# Altium schematic sheet freq-meter.schdoc
size 220 x 160 mm; Symbol: Sheet-Symbol_A5; Device: Sheet-Symbol_A5; Company: 嘉立创EDA; Version: V1.0; Page Size: A5; @Project Name: 51单片机最小系统; @Page Count: 1; @Update Date: 2025-10-24; @Create Date: 2025-10-24; @Schematic Name: Schematic1; @Page No: 1; @Page Name: P1_1; @Board Name: Board2; @Create Time: 05:46:19; @Update Time: 13:48:50
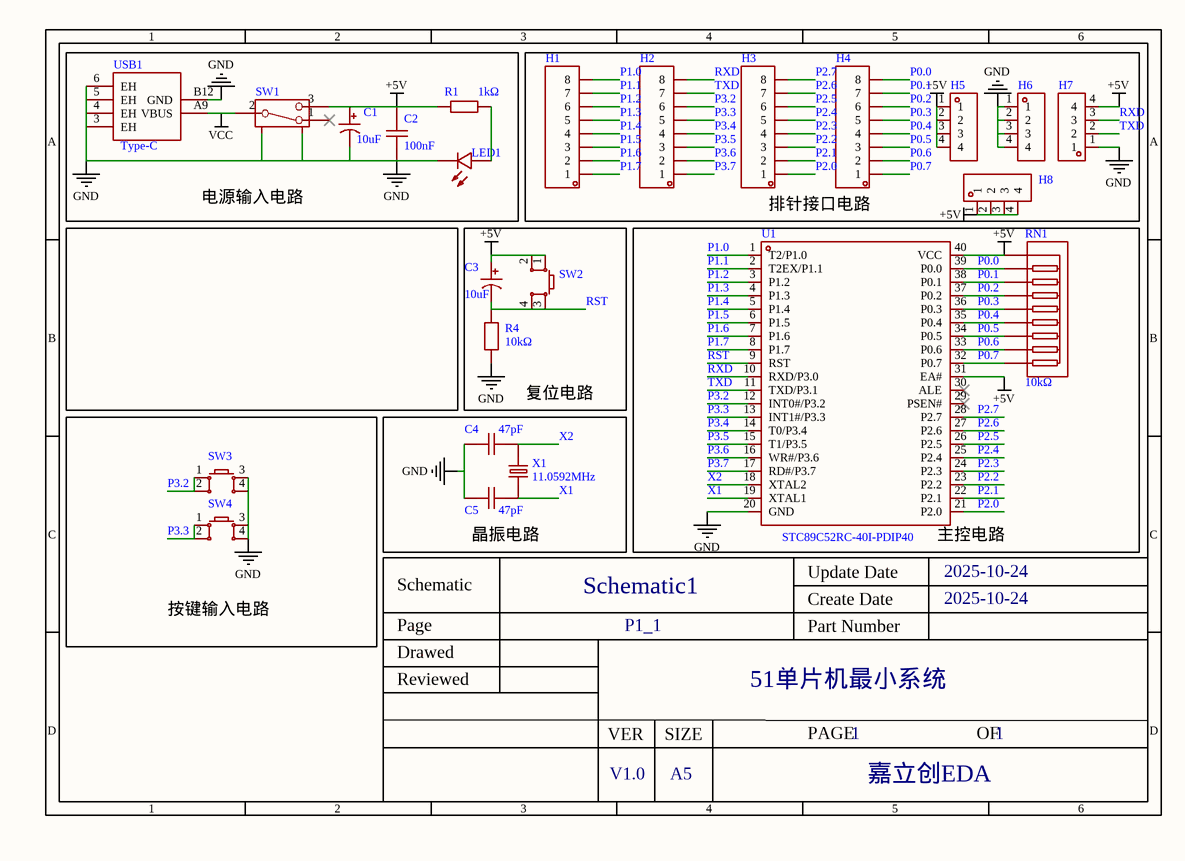
[diagram p0: freq-meter.schdoc]

## Parts
C1  10uF  [CAP-TH_BD5.0-P2.00-D0.8-FD]
C2  100nF  [CAP-TH_L8.5-W5.0-P5.00-D1.2]
C3  10uF  [CAP-TH_BD5.0-P2.00-D0.8-FD]
C4  47pF  [CAP-TH_L4.5-W3.0-P5.00-D1.2]
C5  47pF  [CAP-TH_L4.5-W3.0-P5.00-D1.2]
H1  (no value)  [HDR-TH_8P-P2.54-V-M]
H2  (no value)  [HDR-TH_8P-P2.54-V-M]
H3  (no value)  [HDR-TH_8P-P2.54-V-M]
H4  (no value)  [HDR-TH_8P-P2.54-V-M]
H5  (no value)  [HDR-TH_4P-P2.54-V-M]
H6  (no value)  [HDR-TH_4P-P2.54-V-M]
H7  (no value)  [HDR-TH_4P-P2.54-V-M]
H8  (no value)  [HDR-TH_4P-P2.54-V-M]
LED1  204-10SURD/S530-A3-L  [LED-TH_BD3.0-P2.54-FD]  (value not drawn)
R1  1kΩ  [RES-TH_BD2.5-L6.5-P10.50-D0.6]
R4  10kΩ  [RES-TH_BD2.4-L6.3-P10.30-D0.6]
RN1  10kΩ  [RES-ARRAY-TH_9P-P2.54-D1.0]
SW1  SS-12D02-VG4  [SW-TH_SS-12D02-VG4]  (value not drawn)
SW2  (no value)  [SW-TH_4P-L6.0-W6.0-P4.50-LS6.5]
SW3  (no value)  [SW-TH_4P-L6.0-W6.0-P4.50-LS6.5]
SW4  (no value)  [SW-TH_4P-L6.0-W6.0-P4.50-LS6.5]
U1  STC89C52RC-40I-PDIP40  [DIP-40_L52.0-W13.7-P2.54-LS15.2-BL]
USB1  Connector Type: Type-C  [USB-C-TH_TYPE-C-31-M-33]  (hidden comment: TYPE-C-31-M-33)
X1  11.0592MHz  [HC-49US_L11.5-W4.5-P4.88]

## Blocks framed on the sheet
电源输入电路: C1 C2 LED1 R1 SW1 USB1
排针接口电路: H1-H8
复位电路: C3 R4 SW2
主控电路: RN1 U1
按键输入电路: SW3 SW4
晶振电路: C4 C5 X1

## Nets
+5V: C1.1 C2.2 C3.1 H5.1 H5.2 H5.3 H5.4 H7.4 H8.1 H8.2 H8.3 H8.4 R1.1 RN1.1 SW1.3 SW2.1 SW2.2 U1.31(EA#) U1.40(VCC)
GND: C1.2 C2.1 C4.1 C5.1 H6.1 H6.2 H6.3 H6.4 H7.1 LED1.2(K) R4.1 SW1.4 SW1.5 SW3.3 SW3.4 SW4.3 SW4.4 U1.20(GND) USB1.3(EH) USB1.4(EH) USB1.5(EH) USB1.6(EH) USB1.B12(GND)
VCC: SW1.2 USB1.A9(VBUS)
P0.0: H4.8 RN1.2 U1.39(P0.0)
P0.1: H4.7 RN1.3 U1.38(P0.1)
P0.2: H4.6 RN1.4 U1.37(P0.2)
P0.3: H4.5 RN1.5 U1.36(P0.3)
P0.4: H4.4 RN1.6 U1.35(P0.4)
P0.5: H4.3 RN1.7 U1.34(P0.5)
P0.6: H4.2 RN1.8 U1.33(P0.6)
P0.7: H4.1 RN1.9 U1.32(P0.7)
P1.0: H1.8 U1.1(T2/P1.0)
P1.1: H1.7 U1.2(T2EX/P1.1)
P1.2: H1.6 U1.3(P1.2)
P1.3: H1.5 U1.4(P1.3)
P1.4: H1.4 U1.5(P1.4)
P1.5: H1.3 U1.6(P1.5)
P1.6: H1.2 U1.7(P1.6)
P1.7: H1.1 U1.8(P1.7)
P2.0: H3.1 U1.21(P2.0)
P2.1: H3.2 U1.22(P2.1)
P2.2: H3.3 U1.23(P2.2)
P2.3: H3.4 U1.24(P2.3)
P2.4: H3.5 U1.25(P2.4)
P2.5: H3.6 U1.26(P2.5)
P2.6: H3.7 U1.27(P2.6)
P2.7: H3.8 U1.28(P2.7)
P3.2: H2.6 SW3.1 SW3.2 U1.12(INT0#/P3.2)
P3.3: H2.5 SW4.1 SW4.2 U1.13(INT1#/P3.3)
P3.4: H2.4 U1.14(T0/P3.4)
P3.5: H2.3 U1.15(T1/P3.5)
P3.6: H2.2 U1.16(WR#/P3.6)
P3.7: H2.1 U1.17(RD#/P3.7)
RST: C3.2 R4.2 SW2.3 SW2.4 U1.9(RST)
RXD: H2.8 H7.3 U1.10(RXD/P3.0)
TXD: H2.7 H7.2 U1.11(TXD/P3.1)
X1: C5.2 U1.19(XTAL1) X1.1
X2: C4.2 U1.18(XTAL2) X1.2
NetLED1_1: LED1.1(A) R1.2

Not connected (* = marked no-connect by the designer): SW1 1*; U1 29(PSEN#)* 30(ALE)*

## Notes on the sheet
- 1
- 2
- 3
- 4
- 5
- 6
- A
- B
- C
- Schematic
- Schematic1
- Create Date
- Update Date
- 2025-10-24
- Reviewed
- Drawed
- Page
- P1_1
- Part Number
- 51单片机最小系统
- D
- VER
- SIZE
- PAGE
- OF
- V1.0
- A5
- 嘉立创EDA

## Library data of the parts
C1 C3 = KM106M050D11RR0VH2FP0: Manufacturer: CX(承兴); Symbol: 10uF 50V 5*11; Add into BOM: yes; Tolerance: ±20%; Rated Voltage: 50V; φD: 5mm; L: 11mm; Lifetime @ Temp: 1000hrs@105℃; Device: KM106M050D11RR0VH2FP0; LCSC Part Name: 10uF ±20% 50V; Supplier Part: C43345; Manufacturer Part: KM106M050D11RR0VH2FP0; Supplier Footprint: 插件,D5xL11mm; JLCPCB Part Class: Extended Part; Datasheet: https://atta.szlcsc.com/upload/public/pdf/source/20211027/06D6BA3719C264B639DC286D935D03EA.pdf; Supplier: LCSC; Convert to PCB: yes; Value: 10uF; Lead Spacing: 2mm
C2 = CT4-0805B104K500F3: Manufacturer: FH(风华); Add into BOM: yes; Tolerance: ±10%; Voltage Rated: 50V; Temperature Coefficient: X7R; Symbol: CT4-0805B104K500F3; Device: CT4-0805B104K500F3; LCSC Part Name: 100nF ±10% 50V; Supplier Part: C84772; Manufacturer Part: CT4-0805B104K500F3; Supplier Footprint: 插件,P=5.08mm; JLCPCB Part Class: Extended Part; Datasheet: https://atta.szlcsc.com/upload/public/pdf/source/20161024/1477288669695.pdf; Supplier: LCSC; Convert to PCB: yes; Value: 100nF
C4 C5 = CC1H470JC74DCH4B10MN: Manufacturer: Dersonic(德尔创); Add into BOM: yes; Tolerance: ±5%; Voltage Rated: 50V; Temperature Coefficient: NP0; φD: 4.7mm; Body Thickness: 2.2mm; Symbol: CC1H470JC74DCH4B10MN; Device: CC1H470JC74DCH4B10MN; LCSC Part Name: 47pF ±5% 50V; Supplier Part: C254104; Manufacturer Part: CC1H470JC74DCH4B10MN; Supplier Footprint: 径向引线,P=5.08mm; JLCPCB Part Class: Extended Part; Datasheet: https://atta.szlcsc.com/upload/public/pdf/source/20200826/C254104_4D3B00F203A17FA56AC5131CB4177D5E.pdf; Supplier: LCSC; Convert to PCB: yes; Value: 47pF; Lead Spacing: 5.08mm
H1-H4 = HDR-M_2.54_1x8P: Symbol: Header-Male-2.54_1x8; Convert to PCB: yes; Check: false; Device: HDR-M_2.54_1x8P; Add into BOM: yes; Supplier Part: C124381; Supplier Footprint: 插件
H5-H8 = HDR-M_2.54_1x4P: Symbol: PZ254V-11-04P; Convert to PCB: yes; Check: false; Device: HDR-M_2.54_1x4P; Add into BOM: yes; Supplier Part: C492403; Supplier Footprint: 插件
LED1 = 204-10SURD/S530-A3-L: Manufacturer: EVERLIGHT(亿光); Add into BOM: yes; Emitted Color: 红灯; Lens Color: 雾状红; Dominant Wavelength: 624nm; Peak Wavelength: 632nm; Forward Current: 20mA; Power Dissipation: 60mW; Viewing Angle: 40°; Lamp Holder Type: 3mm圆形灯头; Symbol: 204-10SURD/S530-A3-L; Device: 204-10SURD/S530-A3-L; LCSC Part Name: 红灯 624nm; Supplier Part: C99771; Manufacturer Part: 204-10SURD/S530-A3-L; Supplier Footprint: 插件,D=3mm; JLCPCB Part Class: Extended Part; Datasheet: https://atta.szlcsc.com/upload/public/pdf/source/20170504/1493866972127.pdf; Supplier: LCSC; Convert to PCB: yes; Diode Configuration: -; Color Temperature: -; Mounting Sytle: -; Operating Temperature: -40℃~+85℃
R1 = MFR0W4F1001A50: Manufacturer: UNI-ROYAL(厚声); Add into BOM: yes; Tolerance: ±1%; Power(Watts): 250mW; Temperature Coefficient: ±50ppm/℃; Symbol: MFR0W4F1001A50; Device: MFR0W4F1001A50; LCSC Part Name: 金属膜电阻 1kΩ ±1% 250mW; Supplier Part: C57435; Manufacturer Part: MFR0W4F1001A50; Supplier Footprint: 轴向引线; JLCPCB Part Class: Extended Part; Datasheet: https://atta.szlcsc.com/upload/public/pdf/source/20170615/1497511028539.pdf; Supplier: LCSC; Convert to PCB: yes; Type: 金属膜电阻; Value: 1kΩ
R4 = RN1/4W10KFT/BA1: Manufacturer: Tyohm(幸亚电阻); Add into BOM: yes; Tolerance: ±1%; Power(Watts): 250mW; Temperature Coefficient: ±50ppm/℃; Overload Voltage (Max): 250V; Symbol: RN 1/4W 10K F T/B A1; Device: RN1/4W10KFT/BA1; LCSC Part Name: 金属膜电阻 10kΩ ±1% 250mW; Supplier Part: C410695; Manufacturer Part: RN1/4W10KFT/BA1; Supplier Footprint: 插件; JLCPCB Part Class: Extended Part; Datasheet: https://atta.szlcsc.com/upload/public/pdf/source/20190808/C410695_F4C96186075092C4BC649A77CE7E5B2A.pdf; Supplier: LCSC; Convert to PCB: yes; Type: 金属膜电阻; Value: 10kΩ; Operating Temperature Range: -55℃~+125℃
RN1 = A09-103JP: Manufacturer: FH(风华); Add into BOM: yes; Tolerance: ±5%; Power(Watts): 125mW; Temperature Coefficient: ±100ppm/℃; Number of Resistors: 8; Symbol: A09-103JP; Device: A09-103JP; LCSC Part Name: 10kΩ ±5%; Supplier Part: C8692; Manufacturer Part: A09-103JP; Supplier Footprint: SIP-9-2.54mm; JLCPCB Part Class: Extended Part; Datasheet: https://atta.szlcsc.com/upload/public/pdf/source/20140224/1457706855244.pdf; Supplier: LCSC; Convert to PCB: yes; Value: 10kΩ; Number of Pins: 9
SW1 = SS-12D02-VG4_C136719: Manufacturer: 韩国韩荣; Add into BOM: yes; Circuit: 单刀双掷; Mounting Sytle: 直插; Mechanical Life: 5000; Actuator Style: 矩形柱状; Pin Style: PC引脚; Switch Height: 8.7mm; Symbol: SS-12D02-VG4; Device: SS-12D02-VG4_C136719; LCSC Part Name: SS-12D02-VG4; Supplier Part: C136719; Manufacturer Part: SS-12D02-VG4; Supplier Footprint: 插件; JLCPCB Part Class: Extended Part; Datasheet: https://atta.szlcsc.com/upload/public/pdf/source/20171030/C136719_15093664985151068208.pdf; Supplier: LCSC; Convert to PCB: yes; Current Rating (DC): -; Voltage Rating (DC): -; Current Rating (AC): -; Voltage Rating (AC): -; Operating Temperature: -25℃~+70℃
SW2-SW4 = Key_TH_6x6x6: Symbol: 轻触按键; Convert to PCB: yes; Device: Key_TH_6x6x6; Add into BOM: yes; Supplier Footprint: 插件
  SW2: Supplier Part: F
  SW3 SW4: Supplier Part: C2837516
U1 = STC89C52RC-40I-PDIP40: Manufacturer: STC(宏晶); Add into BOM: yes; CPU Core: 51系列; Supply Voltage Range: 3.3V~5.5V; Program FLASH Size: 8KB; RAM Size: 512Byte; EEPROM/Data FLASH Size: 4KB; GPIO Ports Number: 35; 16Bit Timer Number: 3; U(S)ART Number: 1; Peripherals / Functions / Protocol Stacks: 看门狗; Symbol: STC89C52RC-40I; Device: STC89C52RC-40I-PDIP40; LCSC Part Name: 51系列 闪存：8KB RAM：512Byte; Supplier Part: C14022; Manufacturer Part: STC89C52RC-40I-PDIP40; Supplier Footprint: DIP-40; JLCPCB Part Class: Extended Part; Datasheet: https://atta.szlcsc.com/upload/public/pdf/source/20210104/C14022_3E6032FDBB5DBC6F971AD019A8472F5B.pdf; Supplier: LCSC; Convert to PCB: yes; Maximum Frequency: -; Internal Oscillator: -; External Clock Frequency Rang: -; ADC (Units/Channels/bits): -; DAC (Units/Channels/bits): -; (E)PWM (Units/Channels/bits): -; 8Bit Timer Number: -; 32Bit Timer Number: -; CMP Number: -; I2C Number: -; I2S Number: -; (Q)SPI Number: -; CAN Number: -; USB (H/D/OTG): -; Operating Temperature Range: -40℃~+85℃
USB1 = TYPE-C-31-M-33: Manufacturer: 韩国韩荣; Add into BOM: yes; Gender: 母座; Number of Contacts: 2; Number of Ports: 1; Current Rating - Power (Max): 3A; Symbol: TYPE-C-31-M-33; Device: TYPE-C-31-M-33; LCSC Part Name: Type-C 母座 弯插; Supplier Part: C2848624; Manufacturer Part: TYPE-C-31-M-33; Supplier Footprint: 插件; JLCPCB Part Class: Extended Part; Datasheet: https://atta.szlcsc.com/upload/public/pdf/source/20210810/4286DADA658895E6A7755A4FC585FBE4.pdf; Supplier: LCSC; Convert to PCB: yes; Standard: -; Mounting Style: 弯插; Operating Temperature Range: -30℃~+80℃
X1 = TAXD11.0592M2GLFBET2T: Manufacturer: TAE(雅晶鑫); Symbol: HC-49S11.0592MHZ20PF30PPM; Add into BOM: yes; Crystal Type: 49S晶振; Frequency Tolerance: ±30ppm; Load Capacitance: 20pF; Equivalent Series Resistance (ESR): 50Ω; Device: TAXD11.0592M2GLFBET2T; LCSC Part Name: 11.0592MHz ±30ppm 20pF; Supplier Part: C127675; Manufacturer Part: TAXD11.0592M2GLFBET2T; Supplier Footprint: HC-49S; JLCPCB Part Class: Extended Part; Datasheet: https://atta.szlcsc.com/upload/public/pdf/source/20170914/C127675_1505359414738967689.pdf; Supplier: LCSC; Convert to PCB: yes; Value: 11.0592MHz; Frequency Stability: ±30ppm; Operating Temperature: -